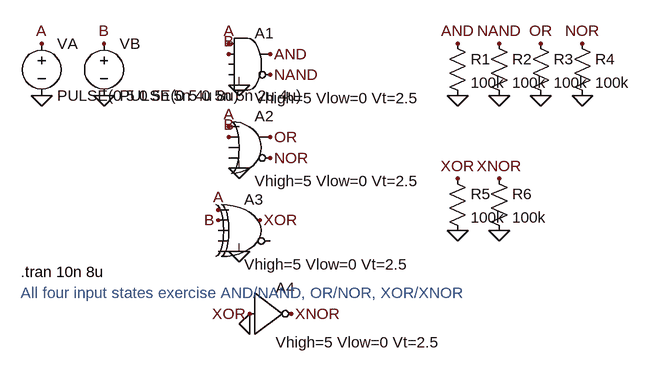
[diagram p0: schematic 14_logic_gate_matrix.asc]
14_logic_gate_matrix.asc, the LTspice schematic file:
Version 4
SHEET 1 1120 760
FLAG 80 96 A
FLAG 80 176 0
FLAG 176 96 B
FLAG 176 176 0
FLAG 368 96 A
FLAG 368 112 B
FLAG 384 160 0
FLAG 432 112 AND
FLAG 432 144 NAND
FLAG 368 224 A
FLAG 368 240 B
FLAG 384 288 0
FLAG 432 240 OR
FLAG 432 272 NOR
FLAG 352 352 A
FLAG 352 368 B
FLAG 384 416 0
FLAG 416 368 XOR
FLAG 400 512 XOR
FLAG 400 528 0
FLAG 464 512 XNOR
FLAG 720 96 AND
FLAG 720 176 0
FLAG 784 96 NAND
FLAG 784 176 0
FLAG 848 96 OR
FLAG 848 176 0
FLAG 912 96 NOR
FLAG 912 176 0
FLAG 720 304 XOR
FLAG 720 384 0
FLAG 784 304 XNOR
FLAG 784 384 0
SYMBOL voltage 80 80 R0
SYMATTR InstName VA
SYMATTR Value PULSE(0 5 0 5n 5n 4u 8u)
SYMBOL voltage 176 80 R0
SYMATTR InstName VB
SYMATTR Value PULSE(0 5 0 5n 5n 2u 4u)
SYMBOL Digital\and 400 64 R0
SYMATTR InstName A1
SYMATTR Value Vhigh=5 Vlow=0 Vt=2.5
SYMBOL Digital\or 400 192 R0
SYMATTR InstName A2
SYMATTR Value Vhigh=5 Vlow=0 Vt=2.5
SYMBOL Digital\xor 400 320 R0
SYMATTR InstName A3
SYMATTR Value Vhigh=5 Vlow=0 Vt=2.5
SYMBOL Digital\inv 400 448 R0
SYMATTR InstName A4
SYMATTR Value Vhigh=5 Vlow=0 Vt=2.5
SYMBOL res 704 80 R0
SYMATTR InstName R1
SYMATTR Value 100k
SYMBOL res 768 80 R0
SYMATTR InstName R2
SYMATTR Value 100k
SYMBOL res 832 80 R0
SYMATTR InstName R3
SYMATTR Value 100k
SYMBOL res 896 80 R0
SYMATTR InstName R4
SYMATTR Value 100k
SYMBOL res 704 288 R0
SYMATTR InstName R5
SYMATTR Value 100k
SYMBOL res 768 288 R0
SYMATTR InstName R6
SYMATTR Value 100k
TEXT 48 448 Left 2 !.tran 10n 8u
TEXT 48 480 Left 2 ;All four input states exercise AND/NAND, OR/NOR, XOR/XNOR

The netlist it stands for:
* 14_logic_gate_matrix.asc
VA A 0 PULSE(0 5 0 5n 5n 4u 8u)
VB B 0 PULSE(0 5 0 5n 5n 2u 4u)
A1 A B 0 0 0 NAND AND 0 AND Vhigh=5 Vlow=0 Vt=2.5
A2 A B 0 0 0 NOR OR 0 OR Vhigh=5 Vlow=0 Vt=2.5
A3 A B 0 0 0 0 XOR 0 XOR Vhigh=5 Vlow=0 Vt=2.5
A4 XOR 0 0 0 0 XNOR 0 0 BUF Vhigh=5 Vlow=0 Vt=2.5
R1 AND 0 100k
R2 NAND 0 100k
R3 OR 0 100k
R4 NOR 0 100k
R5 XOR 0 100k
R6 XNOR 0 100k
.tran 10n 8u
* All four input states exercise AND/NAND, OR/NOR, XOR/XNOR
.backanno
.end